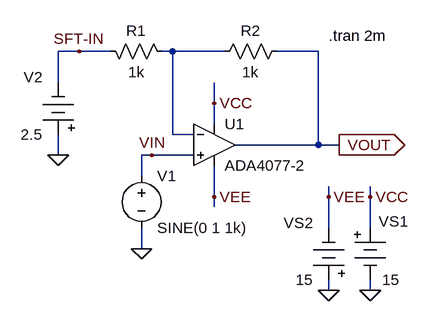
[diagram p0: schematic fig-02-06-06.asc]
fig-02-06-06.asc, the LTspice schematic file:
Version 4
SHEET 1 880 680
WIRE 0 32 -32 32
WIRE 48 32 0 32
WIRE 144 32 128 32
WIRE 224 32 144 32
WIRE 368 32 304 32
WIRE -32 80 -32 32
WIRE 208 112 208 80
WIRE 208 144 208 112
WIRE 144 160 144 32
WIRE 176 160 144 160
WIRE 368 176 368 32
WIRE 368 176 240 176
WIRE 400 176 368 176
WIRE -32 192 -32 160
WIRE 112 192 96 192
WIRE 176 192 112 192
WIRE 96 224 96 192
WIRE 208 256 208 208
WIRE 384 256 384 240
WIRE 448 256 448 240
WIRE 208 272 208 256
WIRE 384 304 384 256
WIRE 448 304 448 256
WIRE 96 336 96 304
WIRE 384 400 384 384
WIRE 448 400 448 384
FLAG 400 176 VOUT
IOPIN 400 176 Out
FLAG 384 400 0
FLAG 448 400 0
FLAG 384 256 VEE
FLAG 448 256 VCC
FLAG 208 112 VCC
FLAG 208 256 VEE
FLAG -32 192 0
FLAG 96 336 0
FLAG 0 32 SFT-IN
FLAG 112 192 VIN
SYMBOL res 320 16 R90
WINDOW 0 0 56 VBottom 2
WINDOW 3 32 56 VTop 2
SYMATTR InstName R2
SYMATTR Value 1k
SYMBOL Misc\\battery 448 288 R0
WINDOW 0 13 6 Left 2
WINDOW 3 18 96 Left 2
SYMATTR InstName VS1
SYMATTR Value 15
SYMBOL Misc\\battery 384 400 R180
WINDOW 0 24 104 Left 2
WINDOW 3 24 16 Left 2
SYMATTR InstName VS2
SYMATTR Value 15
SYMBOL res 32 16 M90
WINDOW 0 0 56 VBottom 2
WINDOW 3 32 56 VTop 2
SYMATTR InstName R1
SYMATTR Value 1k
SYMBOL Opamps\\ADA4077-2 208 112 R0
SYMATTR InstName U1
SYMBOL voltage 96 208 R0
WINDOW 123 0 0 Left 0
WINDOW 39 0 0 Left 0
SYMATTR InstName V1
SYMATTR Value SINE(0 1 1k)
SYMBOL Misc\\battery -32 176 R180
WINDOW 0 24 104 Left 2
WINDOW 3 24 16 Left 2
SYMATTR InstName V2
SYMATTR Value 2.5
TEXT 384 8 Left 2 !.tran 2m

The netlist it stands for:
* fig-02-06-06.asc
R2 VOUT N001 1k
VS1 VCC 0 15
VS2 0 VEE 15
R1 SFT-IN N001 1k
XU1 VIN N001 VCC VEE VOUT ADA4077-2  ; pins In+ In- V+ V- OUT
V1 VIN 0 SINE(0 1 1k)
V2 0 SFT-IN 2.5
.tran 2m
.backanno
.end